# Altium schematic sheet LF_ADC.SchDoc
size A3
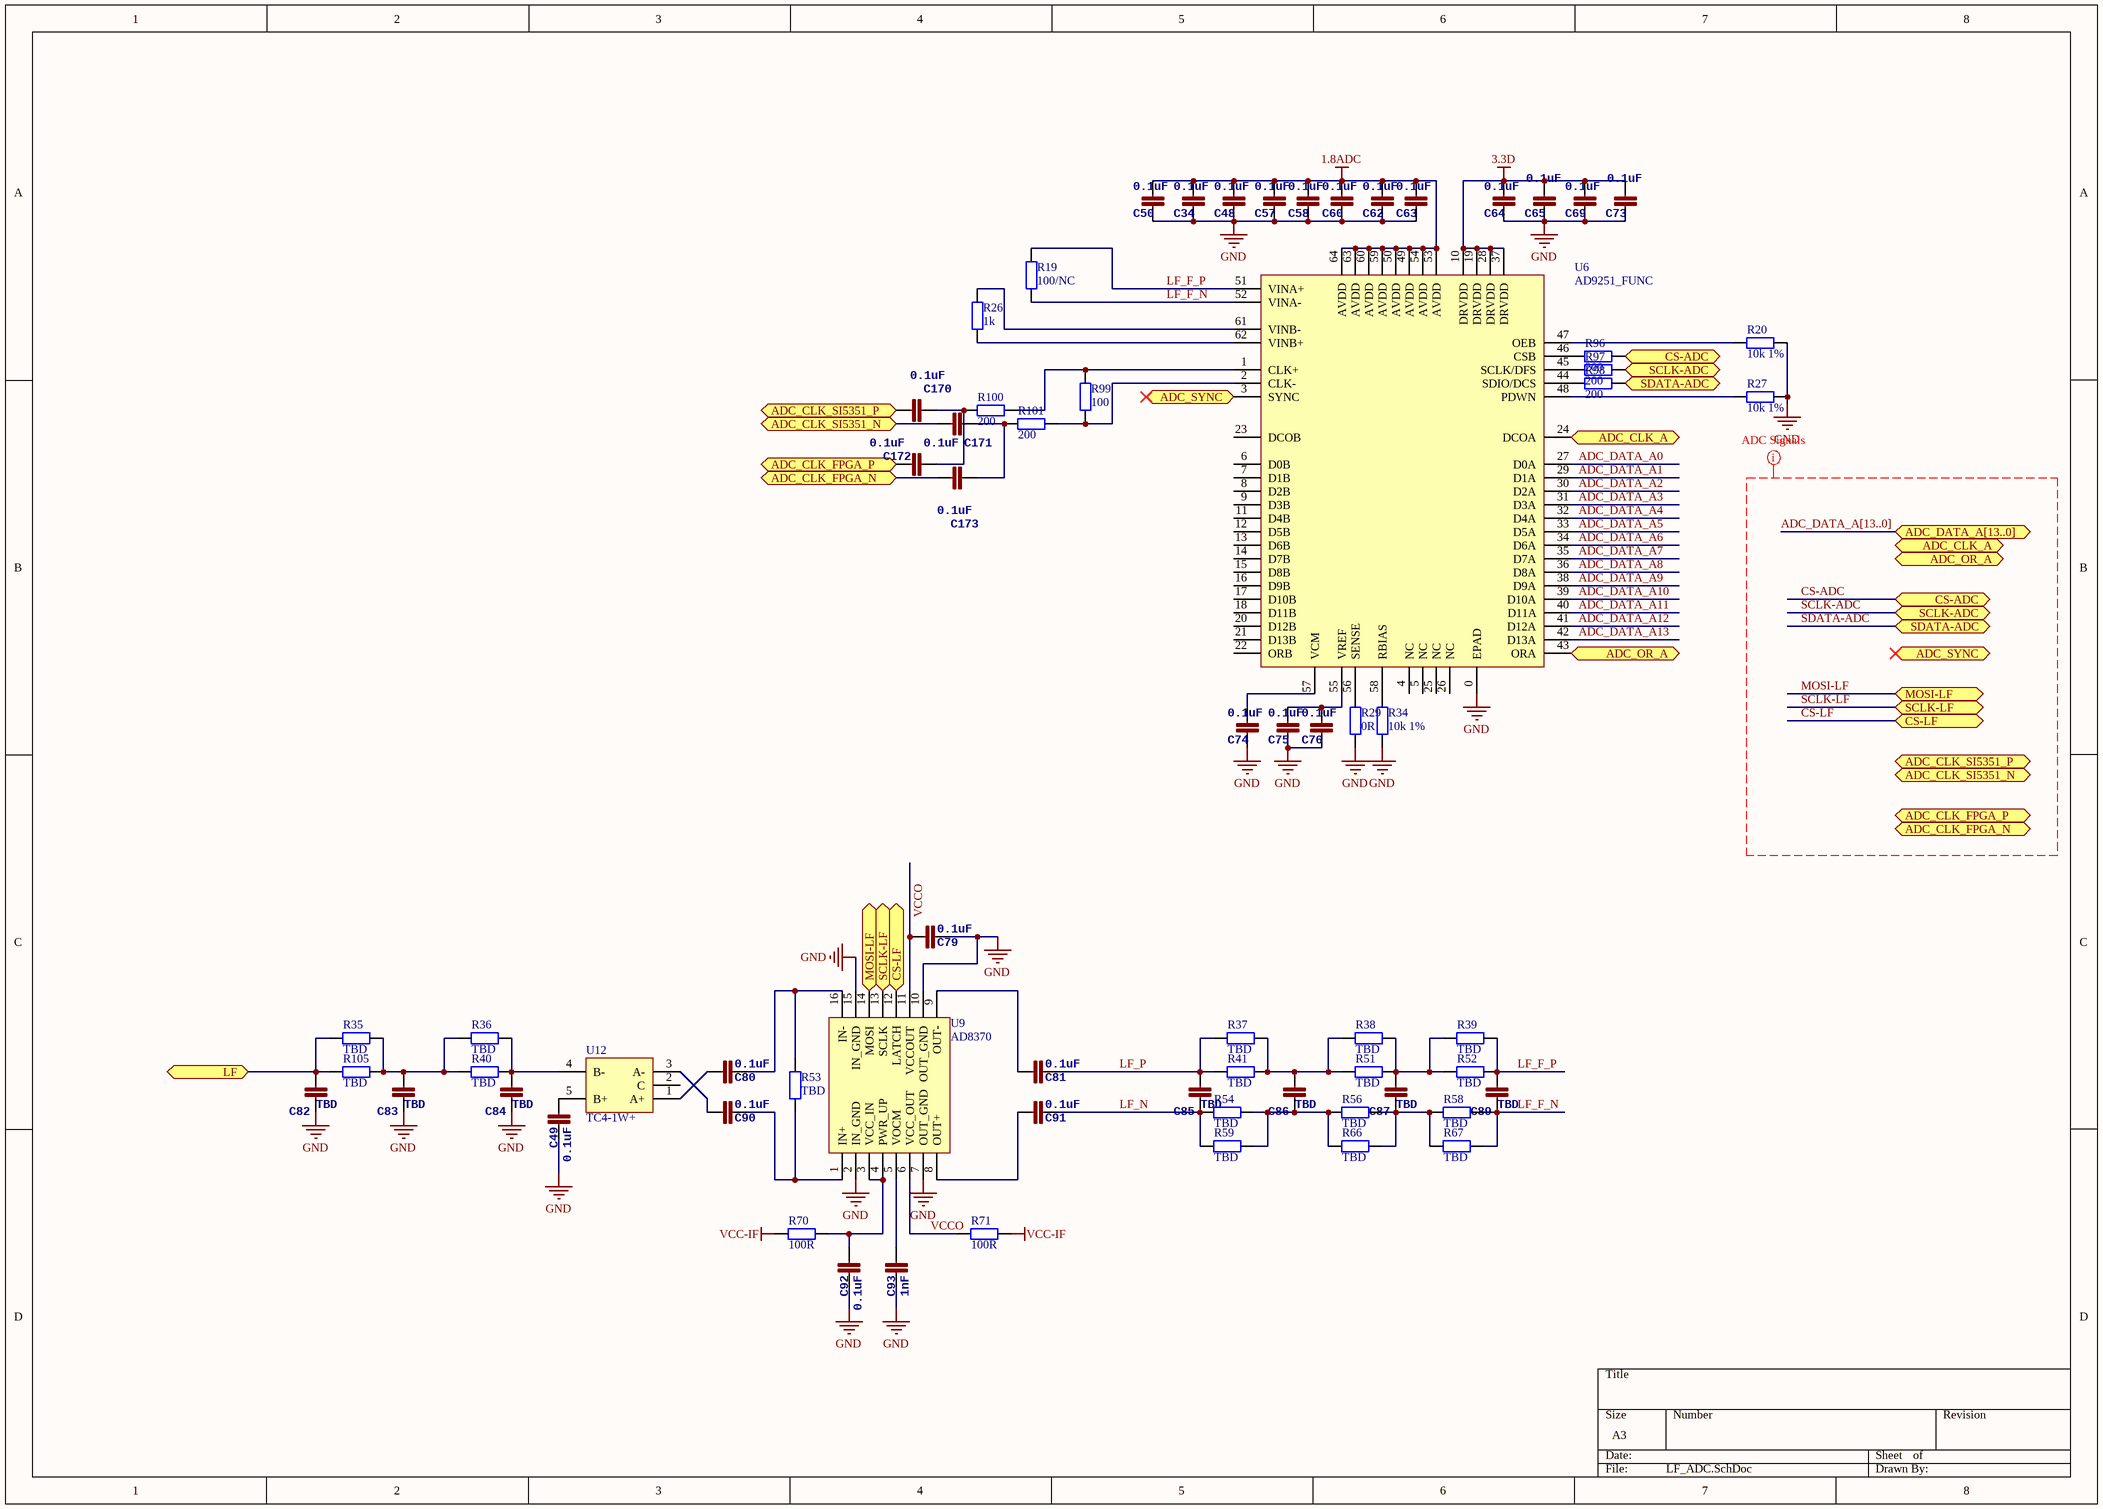
[diagram p0: LF_ADC.SchDoc]

## Parts
C34  0.1uF  [0402]
C48  0.1uF  [0402]
C49  0.1uF  [0402]
C50  0.1uF  [0402]
C57  0.1uF  [0402]
C58  0.1uF  [0402]
C60  0.1uF  [0402]
C62  0.1uF  [0402]
C63  0.1uF  [0402]
C64  0.1uF  [0402]
C65  0.1uF  [0402]
C69  0.1uF  [0402]
C73  0.1uF  [0402]
C74  0.1uF  [0402]
C75  0.1uF  [0402]
C76  0.1uF  [0402]
C79  0.1uF  [0402]
C80  0.1uF  [0402]
C81  0.1uF  [0402]
C82  TBD  [0402]
C83  TBD  [0402]
C84  TBD  [0402]
C85  TBD  [0402]
C86  TBD  [0402]
C87  TBD  [0402]
C89  TBD  [0402]
C90  0.1uF  [0402]
C91  0.1uF  [0402]
C92  0.1uF  [0402]
C93  1nF  [0402]
C170  0.1uF  [0402]
C171  0.1uF  [0402]
C172  0.1uF  [0402]
C173  0.1uF  [0402]
R19  100/NC  [0402]
R20  10k 1%  [0402]
R26  1k  [0402]
R27  10k 1%  [0402]
R29  0R  [0402]
R34  10k 1%  [0402]
R35  TBD  [0402]
R36  TBD  [0402]
R37  TBD  [0402]
R38  TBD  [0402]
R39  TBD  [0402]
R40  TBD  [0402]
R41  TBD  [0402]
R51  TBD  [0402]
R52  TBD  [0402]
R53  TBD  [0402]
R54  TBD  [0402]
R56  TBD  [0402]
R58  TBD  [0402]
R59  TBD  [0402]
R66  TBD  [0402]
R67  TBD  [0402]
R70  100R  [0402]
R71  100R  [0402]
R96  200  [0402]
R97  200  [0402]
R98  200  [0402]
R99  100  [0402]
R100  200  [0402]
R101  200  [0402]
R105  TBD  [0402]
U6  AD9251_FUNC  [AD9251]
U9  AD8370  [TSSOP16_44MM_065P - duplicate]
U12  TC4-1W+  [TCM-63AX+]

## Ports
ADC_CLK_A, ADC_CLK_FPGA_N, ADC_CLK_FPGA_P, ADC_CLK_SI5351_N, ADC_CLK_SI5351_P, ADC_DATA_A[13..0], ADC_OR_A, ADC_SYNC, CS-ADC, CS-LF, LF, MOSI-LF, SCLK-ADC, SCLK-LF, SDATA-ADC

## Nets
1.8ADC: C34.1 C48.1 C50.1 C57.1 C58.1 C60.1 C62.1 C63.1 U6.49(AVDD) U6.50(AVDD) U6.53(AVDD) U6.54(AVDD) U6.59(AVDD) U6.60(AVDD) U6.63(AVDD) U6.64(AVDD)
3.3D: C64.1 C65.1 C69.1 C73.1 U6.10(DRVDD) U6.19(DRVDD) U6.28(DRVDD) U6.37(DRVDD)
GND: C34.2 C48.2 C49.2 C50.2 C57.2 C58.2 C60.2 C62.2 C63.2 C64.2 C65.2 C69.2 C73.2 C74.2 C75.2 C76.2 C79.2 C82.1 C83.1 C84.1 C92.2 C93.2 R20.1 R27.1 R29.1 R34.1 U6.0(EPAD) U9.2(IN_GND) U9.7(OUT_GND) U9.10(OUT_GND) U9.15(IN_GND)
VCC-IF: R70.1 R71.2
ADC_CLK_A: U6.24(DCOA) ; port ADC_CLK_A
ADC_CLK_FPGA_N: C173.1 ; port ADC_CLK_FPGA_N
ADC_CLK_FPGA_P: C172.1 ; port ADC_CLK_FPGA_P
ADC_CLK_SI5351_N: C171.1 ; port ADC_CLK_SI5351_N
ADC_CLK_SI5351_P: C170.1 ; port ADC_CLK_SI5351_P
ADC_DATA_A0: U6.27(D0A)
ADC_DATA_A1: U6.29(D1A)
ADC_DATA_A2: U6.30(D2A)
ADC_DATA_A3: U6.31(D3A)
ADC_DATA_A4: U6.32(D4A)
ADC_DATA_A5: U6.33(D5A)
ADC_DATA_A6: U6.34(D6A)
ADC_DATA_A7: U6.35(D7A)
ADC_DATA_A8: U6.36(D8A)
ADC_DATA_A9: U6.38(D9A)
ADC_DATA_A10: U6.39(D10A)
ADC_DATA_A11: U6.40(D11A)
ADC_DATA_A12: U6.41(D12A)
ADC_DATA_A13: U6.42(D13A)
ADC_OR_A: U6.43(ORA) ; port ADC_OR_A
ADC_SYNC: U6.3(SYNC) ; port ADC_SYNC
CS-ADC: R96.1 ; port CS-ADC
CS-LF: U9.12(LATCH) ; port CS-LF
LF: C82.2 R35.1 R105.1 ; port LF
LF_F_N: C89.1 R19.1 R58.1 R67.1 U6.52(VINA-)
LF_F_P: C89.2 R19.2 R39.2 R52.2 U6.51(VINA+)
LF_N: C85.1 C91.2 R54.2 R59.2
LF_P: C81.2 C85.2 R37.1 R41.1
MOSI-LF: U9.14(MOSI) ; port MOSI-LF
SCLK-ADC: R97.1 ; port SCLK-ADC
SCLK-LF: U9.13(SCLK) ; port SCLK-LF
SDATA-ADC: R98.1 ; port SDATA-ADC
VCCO: C79.1 R71.1 U9.6(VCC_OUT) U9.11(VCCOUT)
NetC49_1: C49.1 U12.5(B+)
NetC74_1: C74.1 U6.57(VCM)
NetC75_1: C75.1 C76.1 U6.55(VREF)
NetC80_1: C80.1 U12.1(A+)
NetC80_2: C80.2 R53.1 U9.16(IN-)
NetC81_1: C81.1 U9.9(OUT-)
NetC83_2: C83.2 R35.2 R36.1 R40.1 R105.2
NetC84_2: C84.2 R36.2 R40.2 U12.4(B-)
NetC86_1: C86.1 R54.1 R56.2 R59.1 R66.2
NetC86_2: C86.2 R37.2 R38.1 R41.2 R51.1
NetC87_1: C87.1 R56.1 R58.2 R66.1 R67.2
NetC87_2: C87.2 R38.2 R39.1 R51.2 R52.1
NetC90_1: C90.1 U12.3(A-)
NetC90_2: C90.2 R53.2 U9.1(IN+)
NetC91_1: C91.1 U9.8(OUT+)
NetC92_1: C92.1 R70.2 U9.3(VCC_IN) U9.4(PWR_UP)
NetC93_1: C93.1 U9.5(VOCM)
NetC170_2: C170.2 C172.2 R100.2
NetC171_2: C171.2 C173.2 R101.2
NetR20_2: R20.2 U6.47(OEB)
NetR26_1: R26.1 U6.62(VINB+)
NetR26_2: R26.2 U6.61(VINB-)
NetR27_2: R27.2 U6.48(PDWN)
NetR29_2: R29.2 U6.56(SENSE)
NetR34_2: R34.2 U6.58(RBIAS)
NetR96_2: R96.2 U6.46(CSB)
NetR97_2: R97.2 U6.45(SCLK/DFS)
NetR98_2: R98.2 U6.44(SDIO/DCS)
NetR99_1: R99.1 R100.1 U6.1(CLK+)
NetR99_2: R99.2 R101.1 U6.2(CLK-)

Not connected (* = marked no-connect by the designer): U6 4(NC) 5(NC) 6(D0B) 7(D1B) 8(D2B) 9(D3B) 11(D4B) 12(D5B) 13(D6B) 14(D7B) 15(D8B) 16(D9B) 17(D10B) 18(D11B) 20(D12B) 21(D13B) 22(ORB) 23(DCOB) 25(NC) 26(NC); U12 2(C)

## Buses and harness runs
bus ADC_DATA_A[13..0] = port ADC_DATA_A[13..0]

## Layout directives
net class ADC Signals: ADC_DATA_A[13..0], CS-ADC, CS-LF, MOSI-LF, SCLK-ADC, SCLK-LF, SDATA-ADC

## Library data of the parts
C34 C48-C50 C57 C58 C60 C62-C65 C69 C73-C76 C79-C87 C89-C93 C170-C173 = CAP0402-CAP: <b>Capacitor</b> / Standard 0603 ceramic capacitor, and 0.1" leaded capacitor.; PARTNO: CC0402ZRY5V7BB104
R19 R20 R26 R27 R29 R34-R41 R51-R54 R56 R58 R59 R66 R67 R70 R71 R96-R101 R105 = Res2: Resistor; Value: 0Ohm; Published: 8-Jun-2000; LatestRevisionDate: 17-Jul-2002; LatestRevisionNote: Re-released for DXP Platform.; PackageReference: AXIAL-0.4; Publisher: Altium Limited; PackageDescription: Axial Device, Thru-Hole; 2 Leads; 0.4 in Pin Spacing
U12 = TCM-63AX+